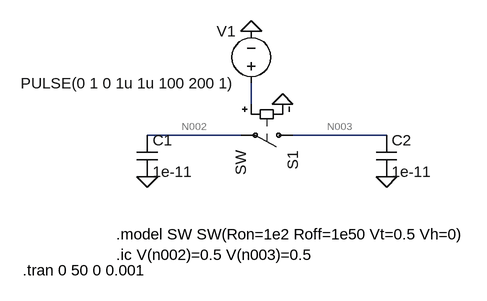
[diagram p0: schematic debug1.asc]
debug1.asc, the LTspice schematic file:
Version 4
SHEET 1 944 680
WIRE 256 80 256 48
WIRE 240 128 96 128
WIRE 464 128 320 128
FLAG 256 -32 0
FLAG 304 80 0
FLAG 464 192 0
FLAG 96 192 0
SYMBOL cap 80 128 R0
SYMATTR InstName C1
SYMATTR Value 1e-11
SYMBOL cap 448 128 R0
SYMATTR InstName C2
SYMATTR Value 1e-11
SYMBOL sw 336 128 R90
SYMATTR InstName S1
SYMBOL voltage 256 64 R180
WINDOW 0 24 96 Left 2
WINDOW 3 24 16 Left 2
WINDOW 123 0 0 Left 2
WINDOW 39 0 0 Left 2
SYMATTR InstName V1
SYMATTR Value PULSE(0 1 0 1u 1u 100 200 1)
TEXT 48 280 Left 2 !.model SW SW(Ron=1e2 Roff=1e50 Vt=0.5 Vh=0)
TEXT 48 312 Left 2 !.ic V(n002)=0.5 V(n003)=0.5
TEXT -96 336 Left 2 !.tran 0 50 0 0.001

The netlist it stands for:
* debug1.asc
C1 N002 0 1e-11
C2 N003 0 1e-11
S1 N003 N002 N001 0 SW
V1 N001 0 PULSE(0 1 0 1u 1u 100 200 1)
.model SW SW(Ron=1e2 Roff=1e50 Vt=0.5 Vh=0)
.ic V(n002)=0.5 V(n003)=0.5
.tran 0 50 0 0.001
.backanno
.end